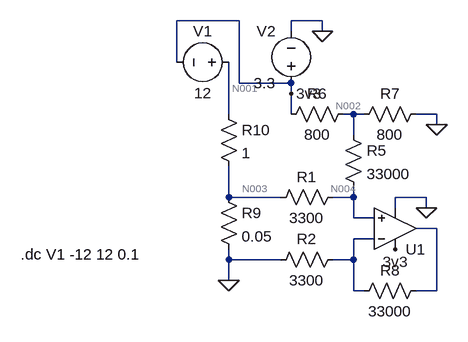
[diagram p0: schematic CurrentSenseSim.asc]
CurrentSenseSim.asc, the LTspice schematic file:
Version 4
SHEET 1 880 680
WIRE 64 -112 -32 -112
WIRE 192 -112 144 -112
WIRE 144 -96 144 -112
WIRE 192 -96 192 -112
WIRE -32 -48 -32 -112
WIRE 64 -16 64 -112
WIRE 144 -16 64 -16
WIRE 144 0 144 -16
WIRE 48 32 48 -48
WIRE 144 32 144 0
WIRE 240 32 224 32
WIRE 256 32 240 32
WIRE 368 32 336 32
WIRE 368 48 368 32
WIRE 240 64 240 32
WIRE 48 160 48 112
WIRE 128 160 48 160
WIRE 240 160 240 144
WIRE 240 160 208 160
WIRE 352 160 304 160
WIRE 304 176 304 160
WIRE 352 176 352 160
WIRE 240 192 240 160
WIRE 272 192 240 192
WIRE 368 208 336 208
WIRE 272 224 240 224
WIRE 48 256 48 240
WIRE 128 256 48 256
WIRE 240 256 240 224
WIRE 240 256 208 256
WIRE 48 288 48 256
WIRE 240 304 240 256
WIRE 256 304 240 304
WIRE 368 304 368 208
WIRE 368 304 336 304
FLAG 48 288 0
FLAG 368 48 0
FLAG 192 -96 0
FLAG 352 176 0
FLAG 144 0 3v3
FLAG 304 240 3v3
SYMBOL res 224 144 R90
WINDOW 0 0 56 VBottom 2
WINDOW 3 32 56 VTop 2
SYMATTR InstName R1
SYMATTR Value 3300
SYMBOL res 224 240 R90
WINDOW 0 0 56 VBottom 2
WINDOW 3 32 56 VTop 2
SYMATTR InstName R2
SYMATTR Value 3300
SYMBOL res 224 48 R0
SYMATTR InstName R5
SYMATTR Value 33000
SYMBOL res 240 16 R90
WINDOW 0 0 56 VBottom 2
WINDOW 3 32 56 VTop 2
SYMATTR InstName R6
SYMATTR Value 800
SYMBOL res 352 16 R90
WINDOW 0 0 56 VBottom 2
WINDOW 3 32 56 VTop 2
SYMATTR InstName R7
SYMATTR Value 800
SYMBOL res 352 288 R90
WINDOW 0 0 56 VBottom 2
WINDOW 3 32 56 VTop 2
SYMATTR InstName R8
SYMATTR Value 33000
SYMBOL res 32 144 R0
SYMATTR InstName R9
SYMATTR Value 0.05
SYMBOL res 32 16 R0
SYMATTR InstName R10
SYMATTR Value 1
SYMBOL voltage 64 -48 R90
WINDOW 0 -32 56 VBottom 2
WINDOW 3 32 56 VTop 2
WINDOW 123 0 0 Left 0
WINDOW 39 0 0 Left 0
SYMATTR InstName V1
SYMATTR Value 12
SYMBOL voltage 144 0 R180
WINDOW 0 24 96 Left 2
WINDOW 3 24 16 Left 2
WINDOW 123 0 0 Left 0
WINDOW 39 0 0 Left 0
SYMATTR InstName V2
SYMATTR Value 3.3
SYMBOL Opamps\\UniversalOpamp2 304 208 M180
SYMATTR InstName U1
TEXT -272 248 Left 2 !.dc V1 -12 12 0.1

The netlist it stands for:
* CurrentSenseSim.asc
R1 N004 N003 3300
R2 N006 0 3300
R5 N002 N004 33000
R6 N002 3v3 800
R7 0 N002 800
R8 N005 N006 33000
R9 N003 0 0.05
R10 N001 N003 1
V1 N001 3v3 12
V2 3v3 0 3.3
XU1 N004 N006 3v3 0 N005 level.2 Avol=1Meg GBW=10Meg Slew=10Meg ilimit=25m rail=0 Vos=0 phimargin=45 en=0 enk=0 in=0 ink=0 Rin=500Meg  ; pins IN+ IN- V+ V- OUT
.dc V1 -12 12 0.1
.lib UniversalOpamps2.sub
.backanno
.end

* Results of the author's LTspice run, read from the files saved beside the schematic
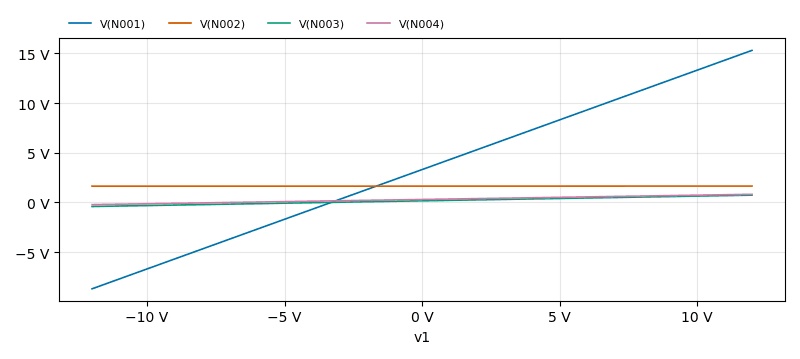
[diagram p1: DC transfer characteristic of CurrentSenseSim.asc, plotted from the saved traces]
* DC transfer characteristic, 1 run:
*   V(N001): -8.7 V at v1=-12 V, 15.3 V at v1=12 V, min -8.7 V, max 15.3 V
*   V(N002): 1.628 V at v1=-12 V, 1.64 V at v1=12 V, min 1.628 V, max 1.64 V
*   V(N003): -414.3 mV at v1=-12 V, 728.6 mV at v1=12 V, min -414.3 mV, max 728.6 mV
*   V(N004): -228.7 mV at v1=-12 V, 811.4 mV at v1=12 V, min -228.7 mV, max 811.4 mV